# EasyEDA schematic test_node.json
TITLE: Sheet_1; REV: 1.0; Date: 2019-07-30; Sheet: 1/1; Drawn By: dskleingeld; Company: Your Company
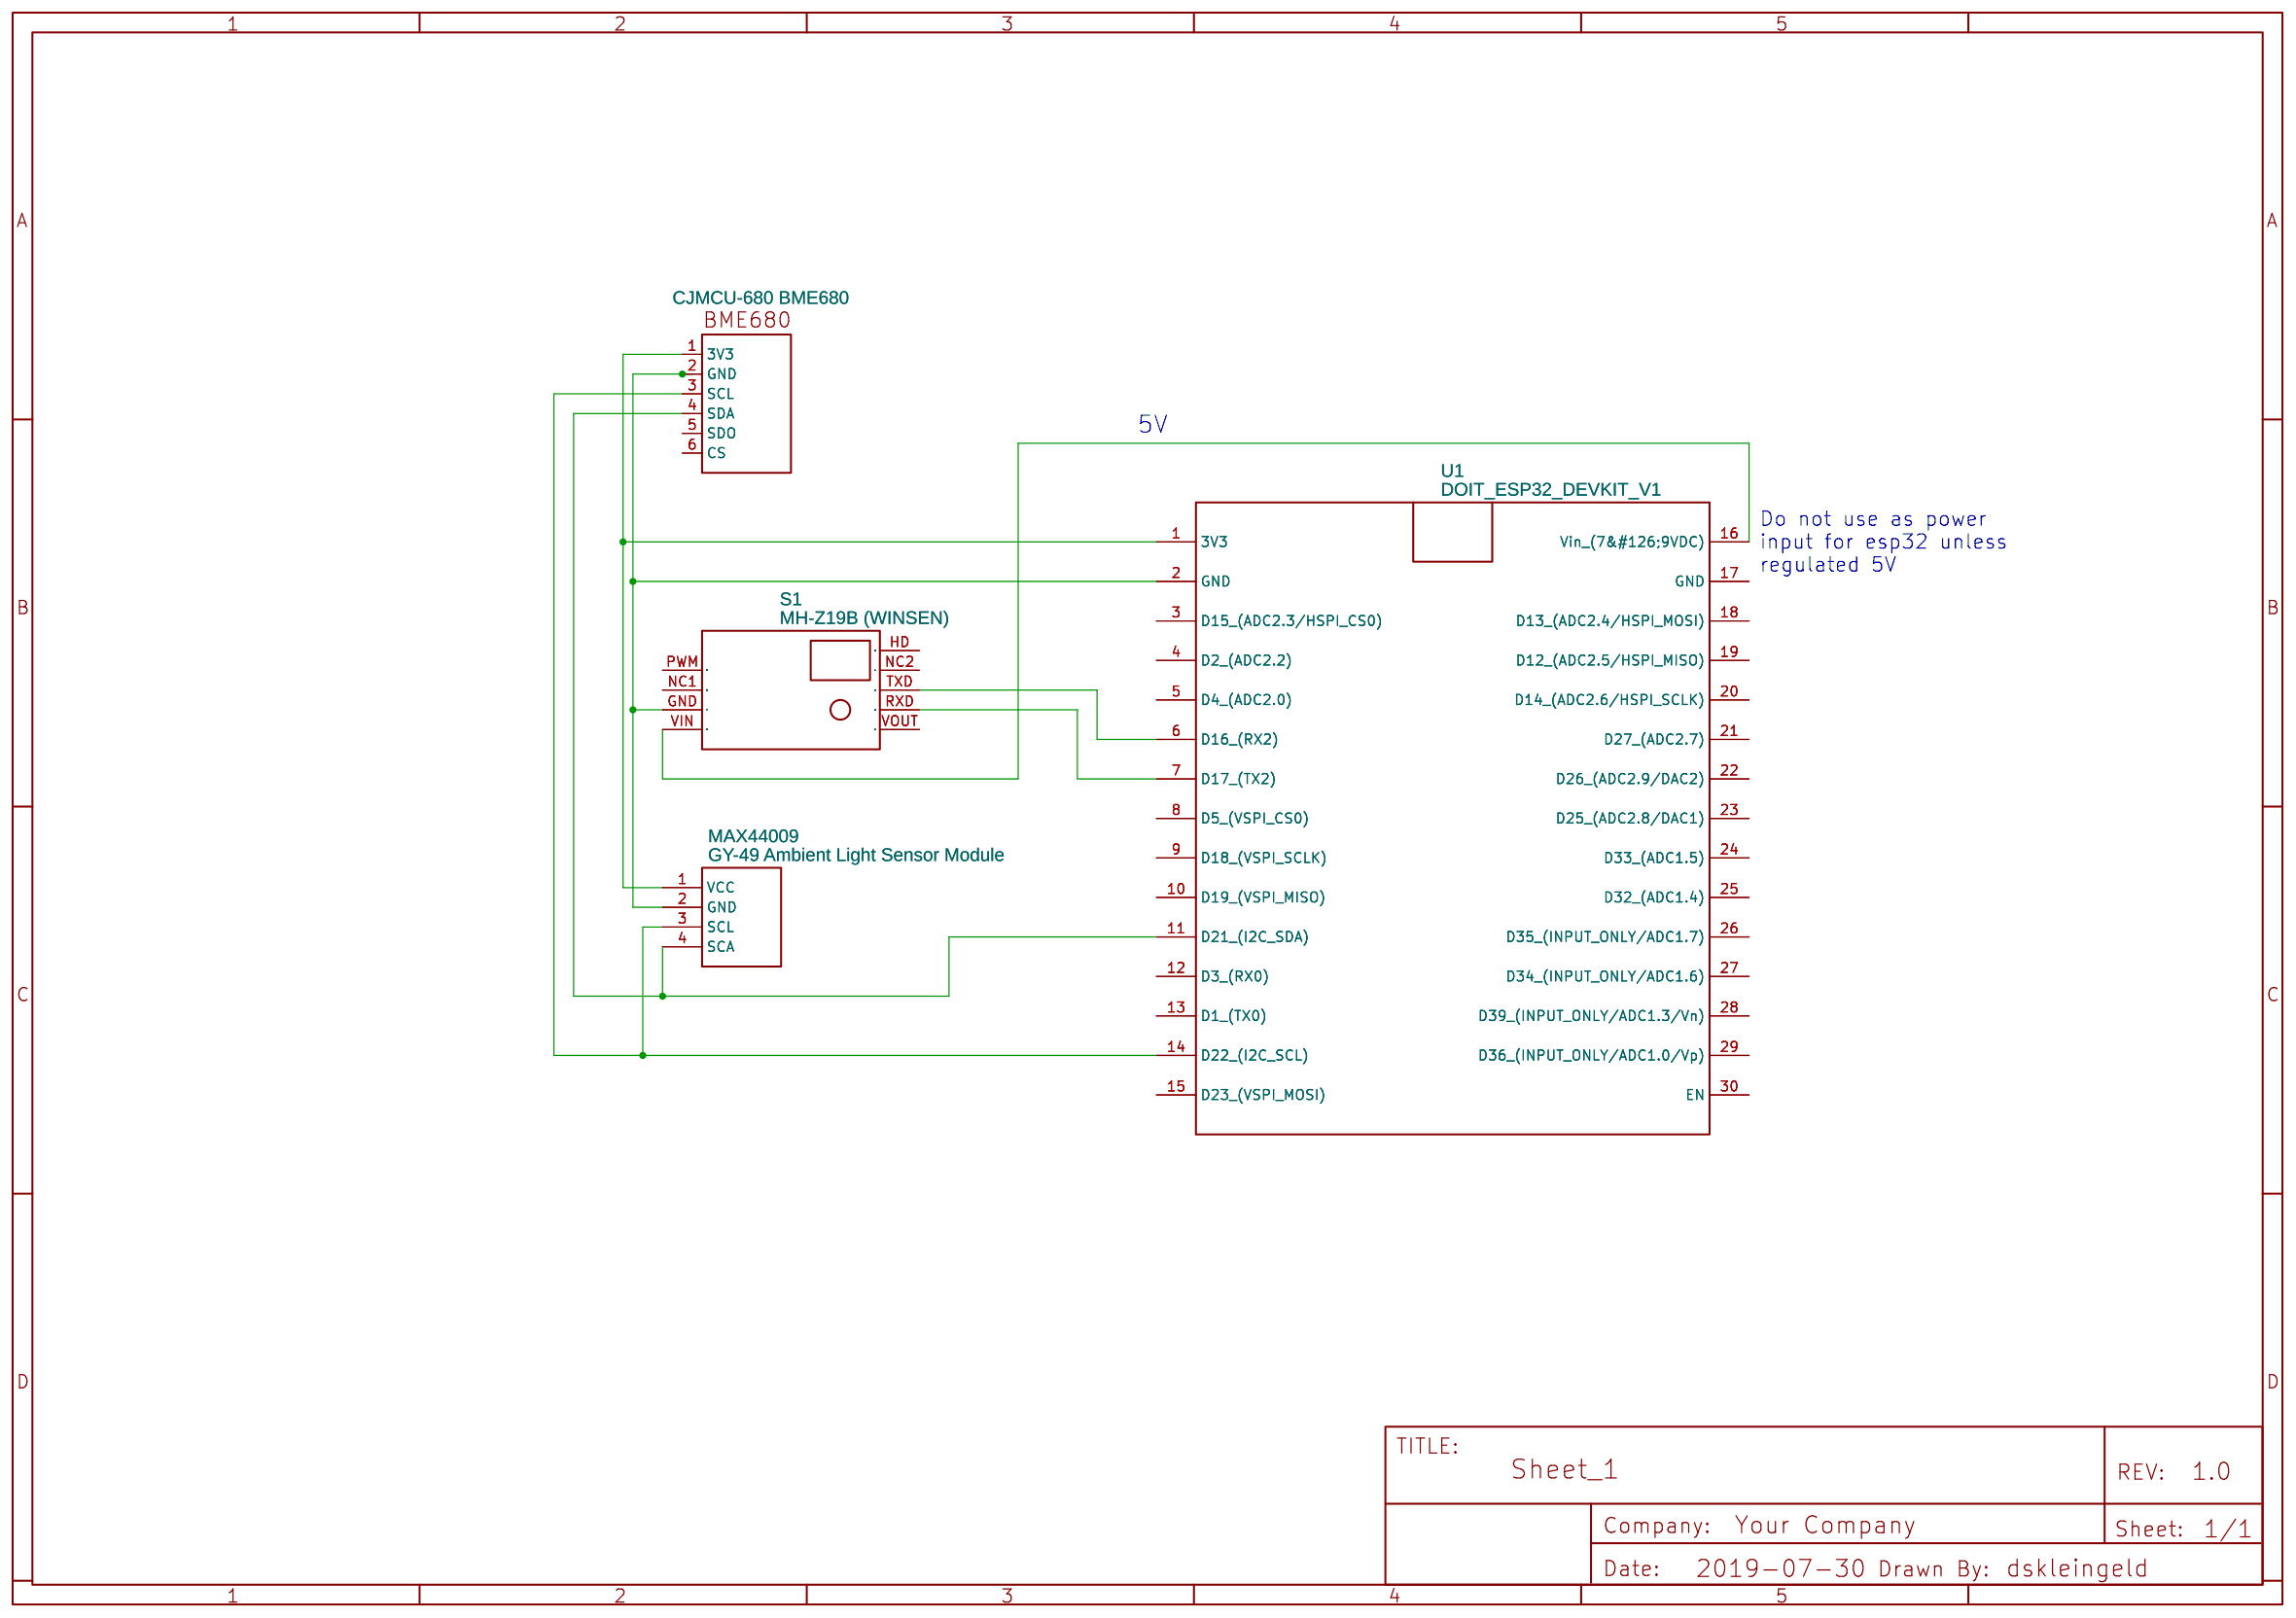
[diagram p0: schematic sheet]

## Parts
MAX44009  GY-49 Ambient Light Sensor Module  [GY-49_MODULE]
S1  MH-Z19B (WINSEN)  [MH-Z19B-PLACE]
U1  DOIT_ESP32_DEVKIT_V1  [DOIT_ESP32]
U2  CJMCU-680 BME680  [BME680]

## Library data of the parts
MAX44009 = -: Manufacturer Part: ?; Contributor: Pjanssen
S1 = -: Manufacturer Part: MH-Z19 (WINSEN); Contributor: Narakot
U1 = -: Manufacturer Part: DOIT ESP32 DEVKIT V1; Contributor: Rudiawan Edwin, M.Si, M.PKim
U2 = -: Supplier Part: C125972; Manufacturer: Bosch Sensortec; Contributor: cammu

## Nets
Net-(MAX44009-1): MAX44009.1(VCC) U1.1(3V3) U2.1(3V3)
Net-(MAX44009-2): MAX44009.2(GND) S1.GND(7) U1.2(GND) U2.2(GND)
Net-(MAX44009-3): MAX44009.3(SCL) U1.14(D22 (I2C SCL)) U2.3(SCL)
Net-(MAX44009-4): MAX44009.4(SCA) U1.11(D21 (I2C SDA)) U2.4(SDA)
Net-(S1-RXD): S1.RXD(2) U1.7(D17 (TX2))
Net-(S1-TXD): S1.TXD(3) U1.6(D16 (RX2))
Net-(S1-VIN): S1.VIN(6) U1.16(Vin (7&#126;9VDC))

Not connected (* = marked no-connect by the designer): S1 HD(5) NC1(8) NC2(4) PWM(9) VOUT(1); U1 3(D15 (ADC2.3/HSPI CS0)) 4(D2 (ADC2.2)) 5(D4 (ADC2.0)) 8(D5 (VSPI CS0)) 9(D18 (VSPI SCLK)) 10(D19 (VSPI MISO)) 12(D3 (RX0)) 13(D1 (TX0)) 15(D23 (VSPI MOSI)) 17(GND) 18(D13 (ADC2.4/HSPI MOSI)) 19(D12 (ADC2.5/HSPI MISO)) 20(D14 (ADC2.6/HSPI SCLK)) 21(D27 (ADC2.7)) 22(D26 (ADC2.9/DAC2)) 23(D25 (ADC2.8/DAC1)) 24(D33 (ADC1.5)) 25(D32 (ADC1.4)) 26(D35 (INPUT ONLY/ADC1.7)) 27(D34 (INPUT ONLY/ADC1.6)) 28(D39 (INPUT ONLY/ADC1.3/Vn)) 29(D36 (INPUT ONLY/ADC1.0/Vp)) 30(EN); U2 5(SDO) 6(CS)

## Notes on the sheet
- 5V
- Do not use as power
  input for esp32 unless
  regulated 5V
